# Altium schematic sheet 人体感应灯控-AltiumDesigner.schdoc
size 423 x 305 mm
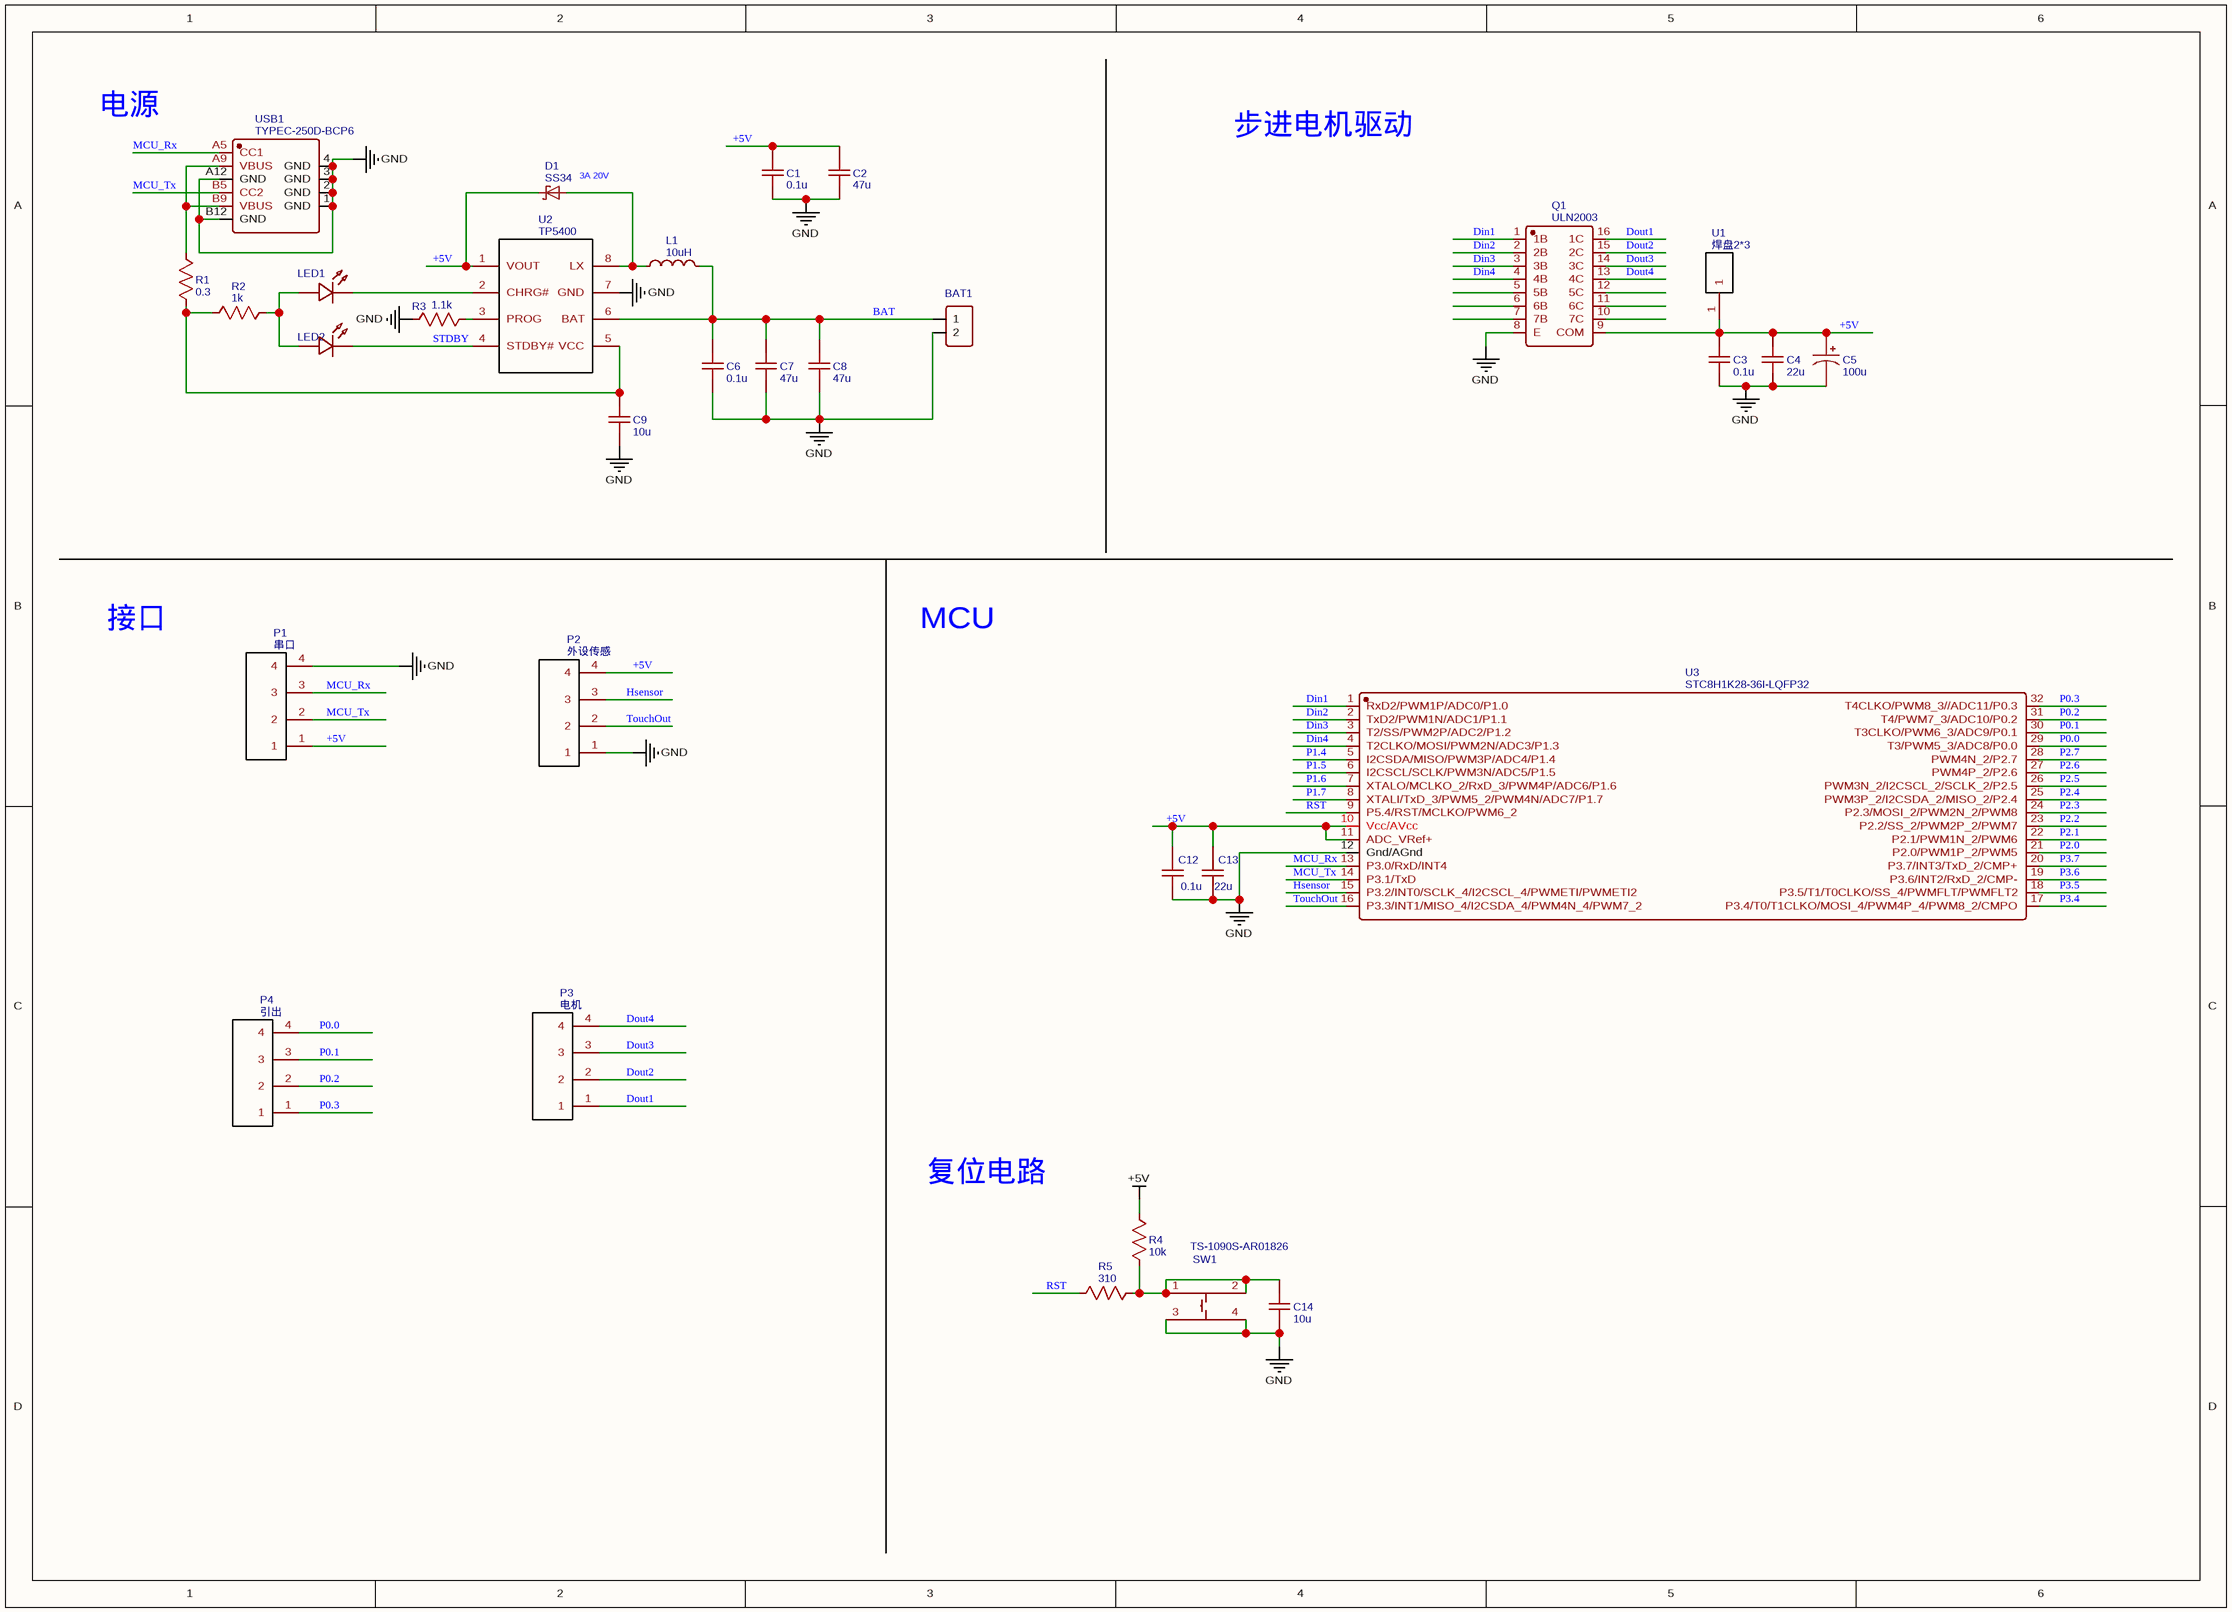
[diagram p0: 人体感应灯控-AltiumDesigner.schdoc]

## Parts
BAT1  HDR-F-2.54_1x2  [HDR-F-2.54_1X2]  (value not drawn)
C1  0.1u  [C0603]
C2  47u  [C1206]
C3  0.1u  [C0603]
C4  22u  [C1206]
C5  100u  [CASE-B_3528]
C6  0.1u  [C0603]
C7  47u  [C1206]
C8  47u  [C1206]
C9  10u  [C1206]
C12  0.1u  [C0603]
C13  22u  [C1206]
C14  10u  [C0603]
D1  SS34  [SMB]
L1  10uH  [0630电感]
LED1  LED-0603_R  [LED0603_RED]  (value not drawn)
LED2  LED-0603_R  [LED0603_RED]  (value not drawn)
P1  串口  [焊盘-2.54-4P]
P2  外设传感  [焊盘-2.54-4P]
P3  电机  [焊盘-2.54-4P]
P4  引出  [焊盘-2.54-4P]
Q1  ULN2003  [SOP-16_L10.0-W3.9-P1.27-LS6.0-BL]
R1  0.3  [R0603]
R2  1k  [R0603]
R3  1.1k  [R0603]
R4  10k  [R0603]
R5  310  [R0603]
SW1  TS-1090S-AR01826  [SW-SMD_4P-L3.5-W3.0-P1.50-LS4.7]
U1  焊盘2*3  [焊盘2*3]
U2  TP5400  [SOIC-8_L5.0-W4.0-P1.27-LS6.0-BL-EP]
U3  STC8H1K28-36I-LQFP32  [LQFP-32_L7.0-W7.0-P0.80-LS9.0-BL]
USB1  TYPEC-250D-BCP6  [USB-C-SMD_TYPEC-250D-BCP6]

## Nets
+5V: C1.2 C2.2 C3.2 C4.2 C5.1 C12.2 C13.2 D1.C P1.1 P2.4 Q1.9(COM) R4.2 U1.1 U2.1(VOUT) U3.10(Vcc/AVcc) U3.11(ADC_VRef+)
GND: BAT1.2 C1.1 C2.1 C3.1 C4.1 C5.2 C6.1 C7.1 C8.1 C9.1 C12.1 C13.1 C14.1 P1.4 P2.1 Q1.8(E) R3.2 SW1.3 SW1.4 U2.7(GND) U3.12(Gnd/AGnd) USB1.1(GND) USB1.2(GND) USB1.3(GND) USB1.4(GND) USB1.A12(GND) USB1.B12(GND)
BAT: BAT1.1 C6.2 C7.2 C8.2 L1.2 U2.6(BAT)
Din1: Q1.1(1B) U3.1(RxD2/PWM1P/ADC0/P1.0)
Din2: Q1.2(2B) U3.2(TxD2/PWM1N/ADC1/P1.1)
Din3: Q1.3(3B) U3.3(T2/SS/PWM2P/ADC2/P1.2)
Din4: Q1.4(4B) U3.4(T2CLKO/MOSI/PWM2N/ADC3/P1.3)
Dout1: P3.1 Q1.16(1C)
Dout2: P3.2 Q1.15(2C)
Dout3: P3.3 Q1.14(3C)
Dout4: P3.4 Q1.13(4C)
Hsensor: P2.3 U3.15(P3.2/INT0/SCLK_4/I2CSCL_4/PWMETI/PWMETI2)
MCU_Rx: P1.3 U3.13(P3.0/RxD/INT4) USB1.A5(CC1)
MCU_Tx: P1.2 U3.14(P3.1/TxD) USB1.B5(CC2)
P0.0: P4.4 U3.29(T3/PWM5_3/ADC8/P0.0)
P0.1: P4.3 U3.30(T3CLKO/PWM6_3/ADC9/P0.1)
P0.2: P4.2 U3.31(T4/PWM7_3/ADC10/P0.2)
P0.3: P4.1 U3.32(T4CLKO/PWM8_3//ADC11/P0.3)
P1.4: U3.5(I2CSDA/MISO/PWM3P/ADC4/P1.4)
P1.5: U3.6(I2CSCL/SCLK/PWM3N/ADC5/P1.5)
P1.6: U3.7(XTALO/MCLKO_2/RxD_3/PWM4P/ADC6/P1.6)
P1.7: U3.8(XTALI/TxD_3/PWM5_2/PWM4N/ADC7/P1.7)
P2.0: U3.21(P2.0/PWM1P_2/PWM5)
P2.1: U3.22(P2.1/PWM1N_2/PWM6)
P2.2: U3.23(P2.2/SS_2/PWM2P_2/PWM7)
P2.3: U3.24(P2.3/MOSI_2/PWM2N_2/PWM8)
P2.4: U3.25(PWM3P_2/I2CSDA_2/MISO_2/P2.4)
P2.5: U3.26(PWM3N_2/I2CSCL_2/SCLK_2/P2.5)
P2.6: U3.27(PWM4P_2/P2.6)
P2.7: U3.28(PWM4N_2/P2.7)
P3.4: U3.17(P3.4/T0/T1CLKO/MOSI_4/PWM4P_4/PWM8_2/CMPO)
P3.5: U3.18(P3.5/T1/T0CLKO/SS_4/PWMFLT/PWMFLT2)
P3.6: U3.19(P3.6/INT2/RxD_2/CMP-)
P3.7: U3.20(P3.7/INT3/TxD_2/CMP+)
RST: R5.2 U3.9(P5.4/RST/MCLKO/PWM6_2)
STDBY: LED2.2 U2.4(STDBY#)
TouchOut: P2.2 U3.16(P3.3/INT1/MISO_4/I2CSDA_4/PWM4N_4/PWM7_2)
NetC9_2: C9.2 R1.2 R2.2 U2.5(VCC)
NetC14_2: C14.2 R4.1 R5.1 SW1.1 SW1.2
NetD1_A: D1.A L1.1 U2.8(LX)
NetLED1_1: LED1.1 LED2.1 R2.1
NetLED1_2: LED1.2 U2.2(CHRG#)
NetR1_1: R1.1 USB1.A9(VBUS) USB1.B9(VBUS)
NetR3_1: R3.1 U2.3(PROG)

Not connected (* = marked no-connect by the designer): Q1 5(5B) 6(6B) 7(7B) 10(7C) 11(6C) 12(5C)

## Notes on the sheet
- 电源
- 步进电机驱动
- (near D1) 3A 20V
- 接口
- MCU
- 复位电路

## Library data of the parts
BAT1 = HDR-F-2.54_1x2: Contributor: LCEDA_Lib; Package Display: No; BOM_Supplier Part: C49661; BOM_Supplier: LCSC; spicePre: H; spiceSymbolName: HDR-F-2.54_1x2
C1 C3 C6 C12 = 0.1u: nameAlias: Value(F); Contributor: LCEDA_Lib; spicePre: C; spiceSymbolName: C_0603_US
C2 C7 C8 = 47u: nameAlias: Value(F); Contributor: LCEDA_Lib; spicePre: C; spiceSymbolName: C_0603_US
C4 C13 = 22u: nameAlias: Value(F); Contributor: LCEDA_Lib; spicePre: C; spiceSymbolName: C_0603_US
C5 = 100u: nameAlias: Value(F); Contributor: LCEDA_Lib; spicePre: C; spiceSymbolName: C_Tan_SMD_A_US
C9 C14 = 10u: nameAlias: Value(F); Contributor: LCEDA_Lib; spicePre: C; spiceSymbolName: C_0603_US
D1 = SS34: description: null; spicePre: D; spiceSymbolName: SS34
L1 = 10uH: nameAlias: Value(H); Contributor: LCEDA_Lib; Package Display: No; spicePre: L; spiceSymbolName: L0603_US
LED1 LED2 = LED-0603_R: BOM_Manufacturer: EVERLIGHT(台湾亿光); BOM_Manufacturer Part: 19-217/R6C-AL1M2VY/3T; Contributor: LCEDA_01; BOM_Supplier Part: C72044; BOM_Supplier: LCSC; spicePre: L; spiceSymbolName: LED-0603_R
P1 = 串口: BOM_Manufacturer Part: New SchematicLib; Contributor: zhouweitian8888; spicePre: P; spiceSymbolName: 金手指2.54*4
P2 = 外设传感: BOM_Manufacturer Part: New SchematicLib; Contributor: zhouweitian8888; spicePre: P; spiceSymbolName: 金手指2.54*4
P3 = 电机: BOM_Manufacturer Part: New SchematicLib; Contributor: zhouweitian8888; spicePre: P; spiceSymbolName: 金手指2.54*4
P4 = 引出: BOM_Manufacturer Part: New SchematicLib; Contributor: zhouweitian8888; spicePre: P; spiceSymbolName: 金手指2.54*4
Q1 = ULN2003: BOM_Manufacturer: Shanghai Siproin Microelectronics; Contributor: LCSC; BOM_Paste Type: expand; BOM_Assembly Type: smtWeld; BOM_Supplier: LCSC; BOM_Supplier Part: C411052; BOM_Manufacturer Part: ULN2003; spicePre: Q; spiceSymbolName: ULN2003
R1 = 0.3: nameAlias: Value(Ω); Contributor: LCEDA_Lib; spicePre: R; spiceSymbolName: R_0603_US
R2 = 1k: nameAlias: Value(Ω); Contributor: LCEDA_Lib; spicePre: R; spiceSymbolName: R_0603_US
R3 = 1.1k: nameAlias: Value(Ω); Contributor: LCEDA_Lib; spicePre: R; spiceSymbolName: R_0603_US
R4 = 10k: nameAlias: Value(Ω); Contributor: LCEDA_Lib; spicePre: R; spiceSymbolName: R_0603_US
R5 = 310: nameAlias: Value(Ω); Contributor: LCEDA_Lib; spicePre: R; spiceSymbolName: R_0603_US
SW1 = TS-1090S-AR01826: BOM_Manufacturer: XUNPU(讯普); Contributor: LCSC; BOM_Supplier: LCSC; BOM_Supplier Part: C920224; BOM_Manufacturer Part: TS-1090S-AR01826; spicePre: S; spiceSymbolName: TS-1090S-AR01826
U1 = 焊盘2*3: Contributor: Tsinghua_Lee; spicePre: U; spiceSymbolName: 焊盘2*3
U2 = TP5400: BOM_Manufacturer: TOPPOWER; BOM_Paste Type: expand; BOM_Assembly Type: smtWeld; BOM_Supplier: LCSC; BOM_Manufacturer Part: TP5400; image: //image.lceda.cn/szlcsc/C24154.jpg; BOM_Supplier Part: C24154; spicePre: U; spiceSymbolName: TP5400
U3 = STC8H1K28-36I-LQFP32: BOM_Manufacturer: STC Micro; Contributor: LCSC; BOM_Paste Type: expand; BOM_Assembly Type: smtWeld; BOM_Supplier: LCSC; BOM_Supplier Part: C914618; BOM_Manufacturer Part: STC8H1K28-36I-LQFP32; spicePre: U; spiceSymbolName: STC8H1K28-36I-LQFP32
USB1 = TYPEC-250D-BCP6: BOM_Manufacturer: XUNPU; Contributor: LCSC; BOM_Supplier: LCSC; BOM_Supplier Part: C720626; BOM_Manufacturer Part: TYPEC-250D-BCP6; spicePre: U; spiceSymbolName: TYPEC-250D-BCP6